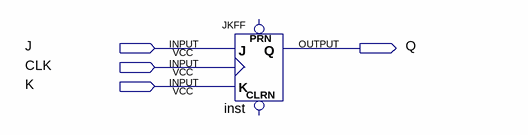
[diagram p0: schematic sheet]
// Quartus schematic JKFF_test.bdf as structural Verilog: 1 symbols, 4 pins
module JKFF_test (
  input  J,
  input  CLK,
  input  K,
  output Q
);

  JKFF inst (.K(K), .J(J), .CLK(CLK), .Q(Q));  // open: PRN, CLRN
endmodule
